# EasyEDA Pro project avaruusantenni_tallylight.eprj, schematic Schematic1

## Sheets
1 MCU: Create Date: 2023-07-29; Page Name: MCU; Project Name: avaruusantenni_tallylight; Schematic Name: Schematic1; Update Date: 2023-12-21; Company: EasyEDA.com; Drawed: EasyEDA Pro; Page Size: A4; Part Number: JLCPCB-002; Reviewed: EasyEDA Pro; Version: V0.1
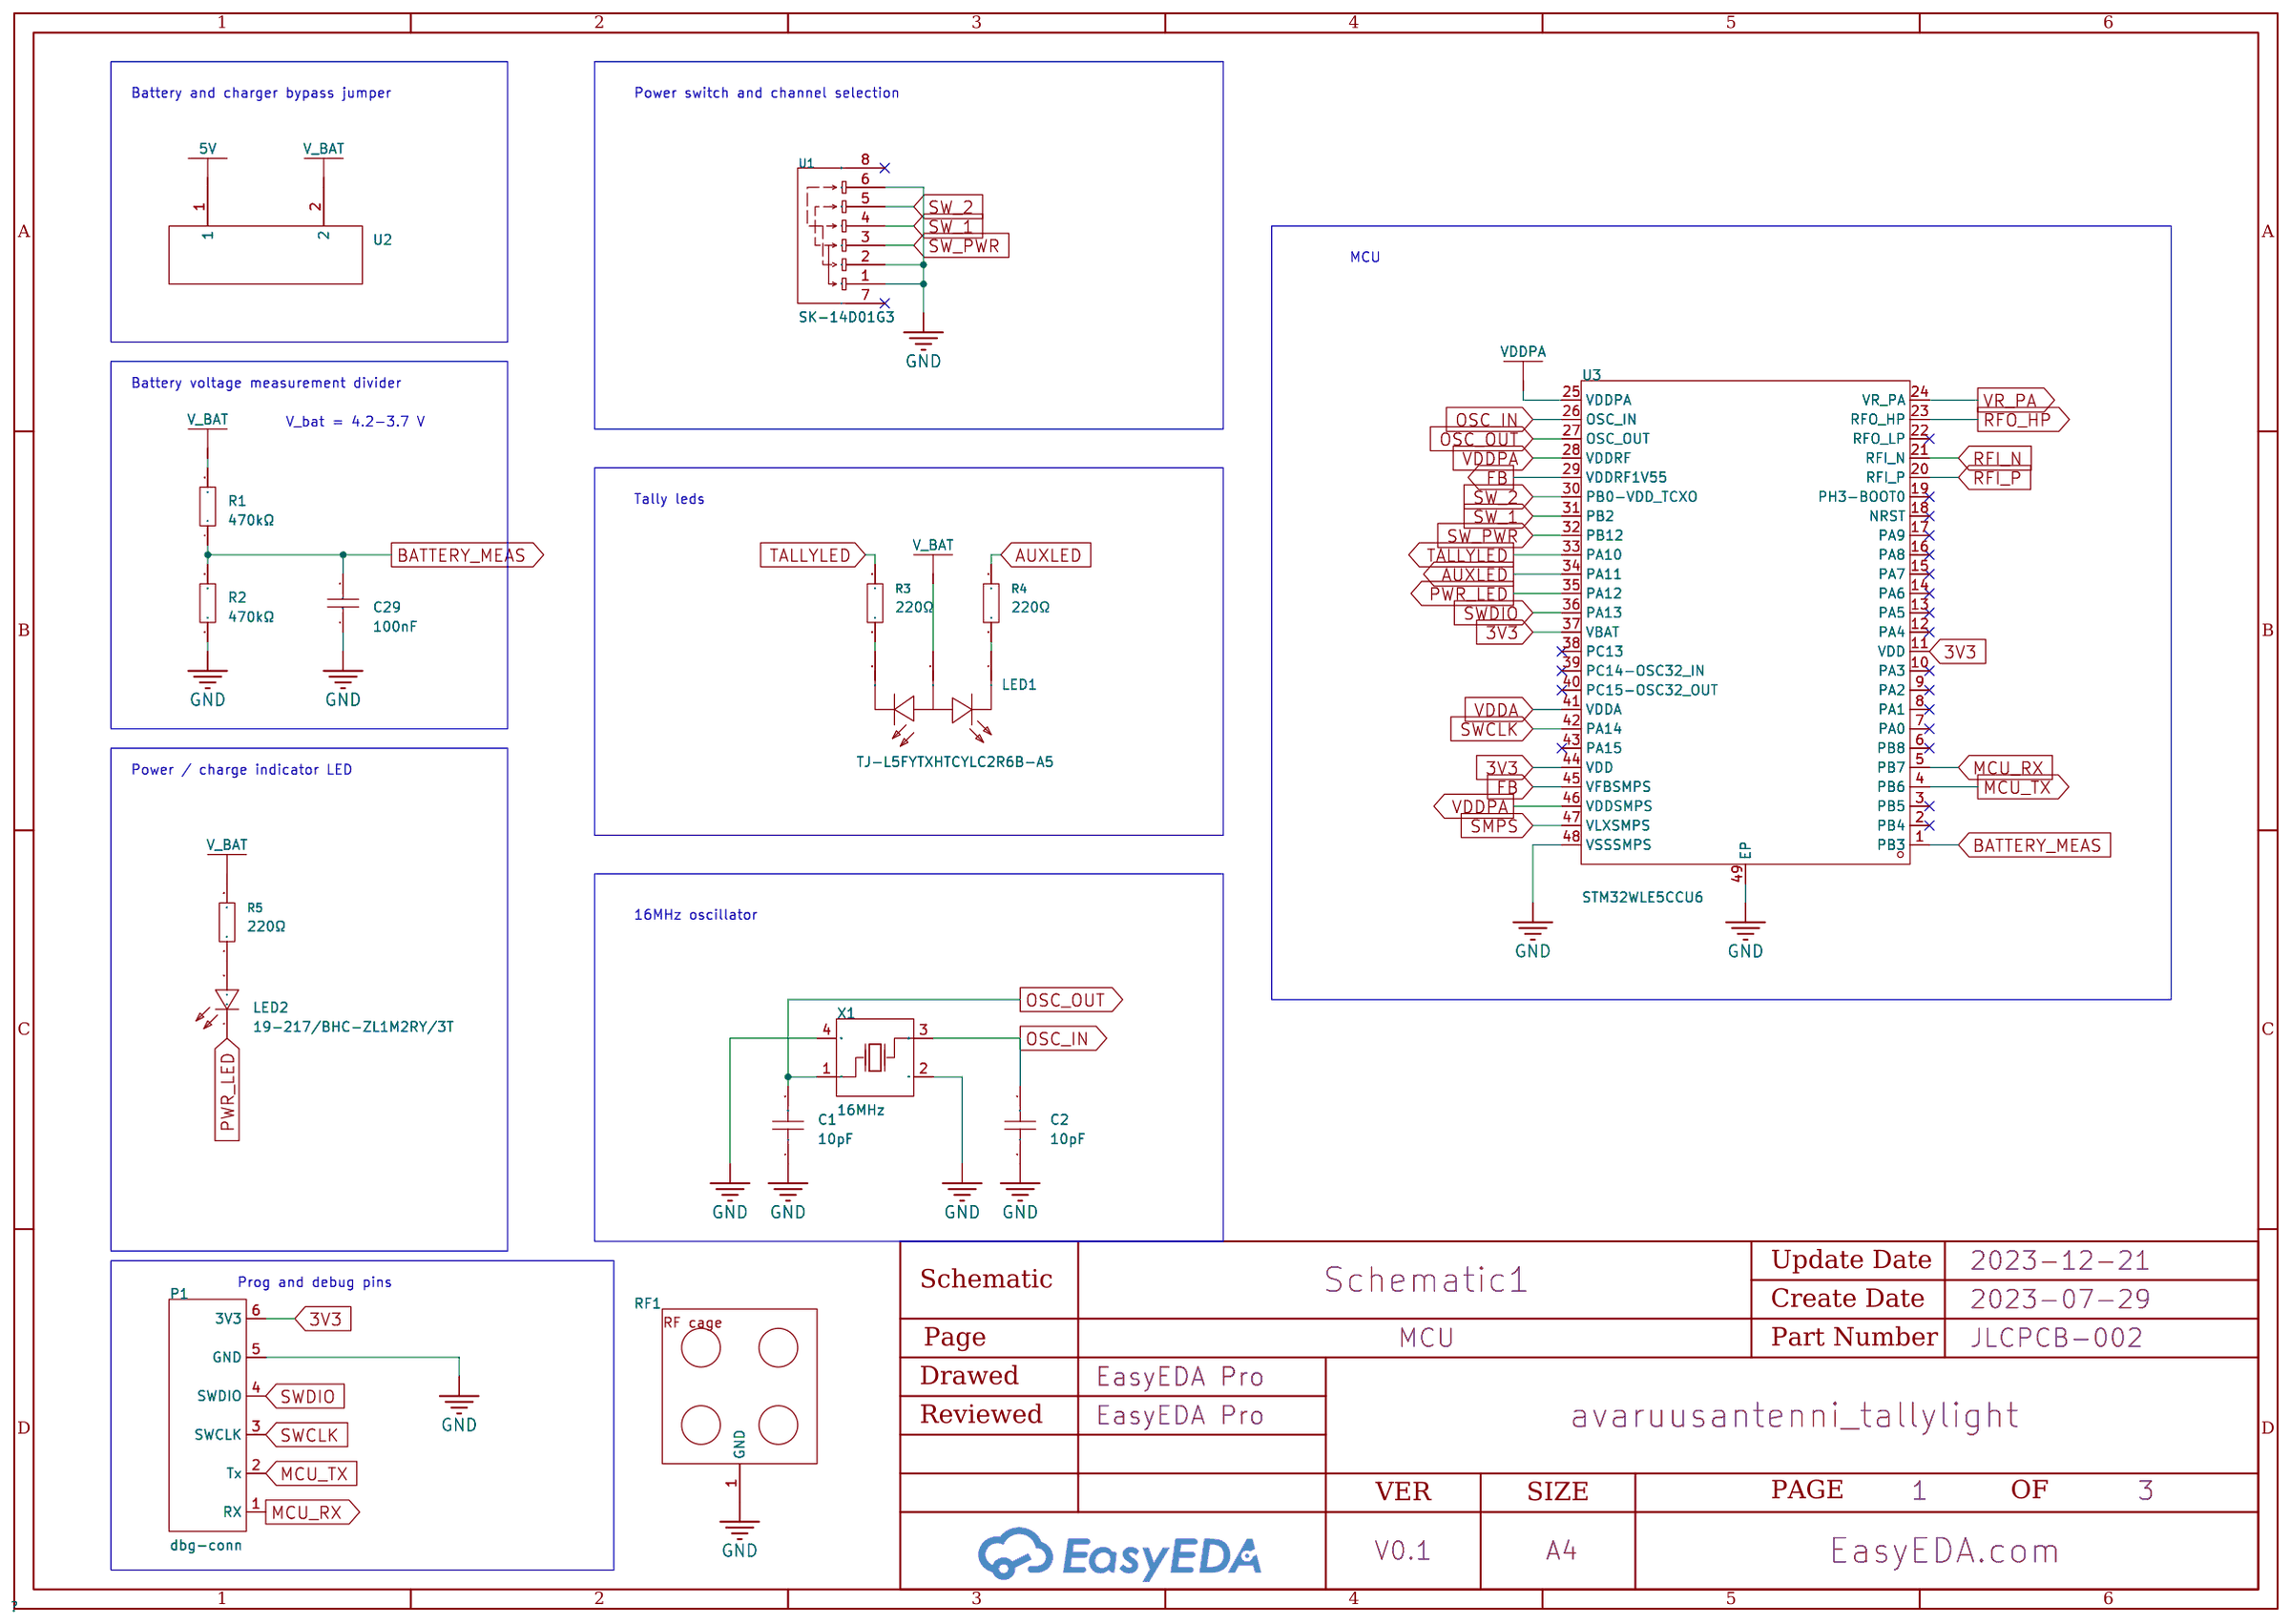
[diagram p0: MCU]
2 PWR: Create Date: 2023-10-14; Page Name: PWR
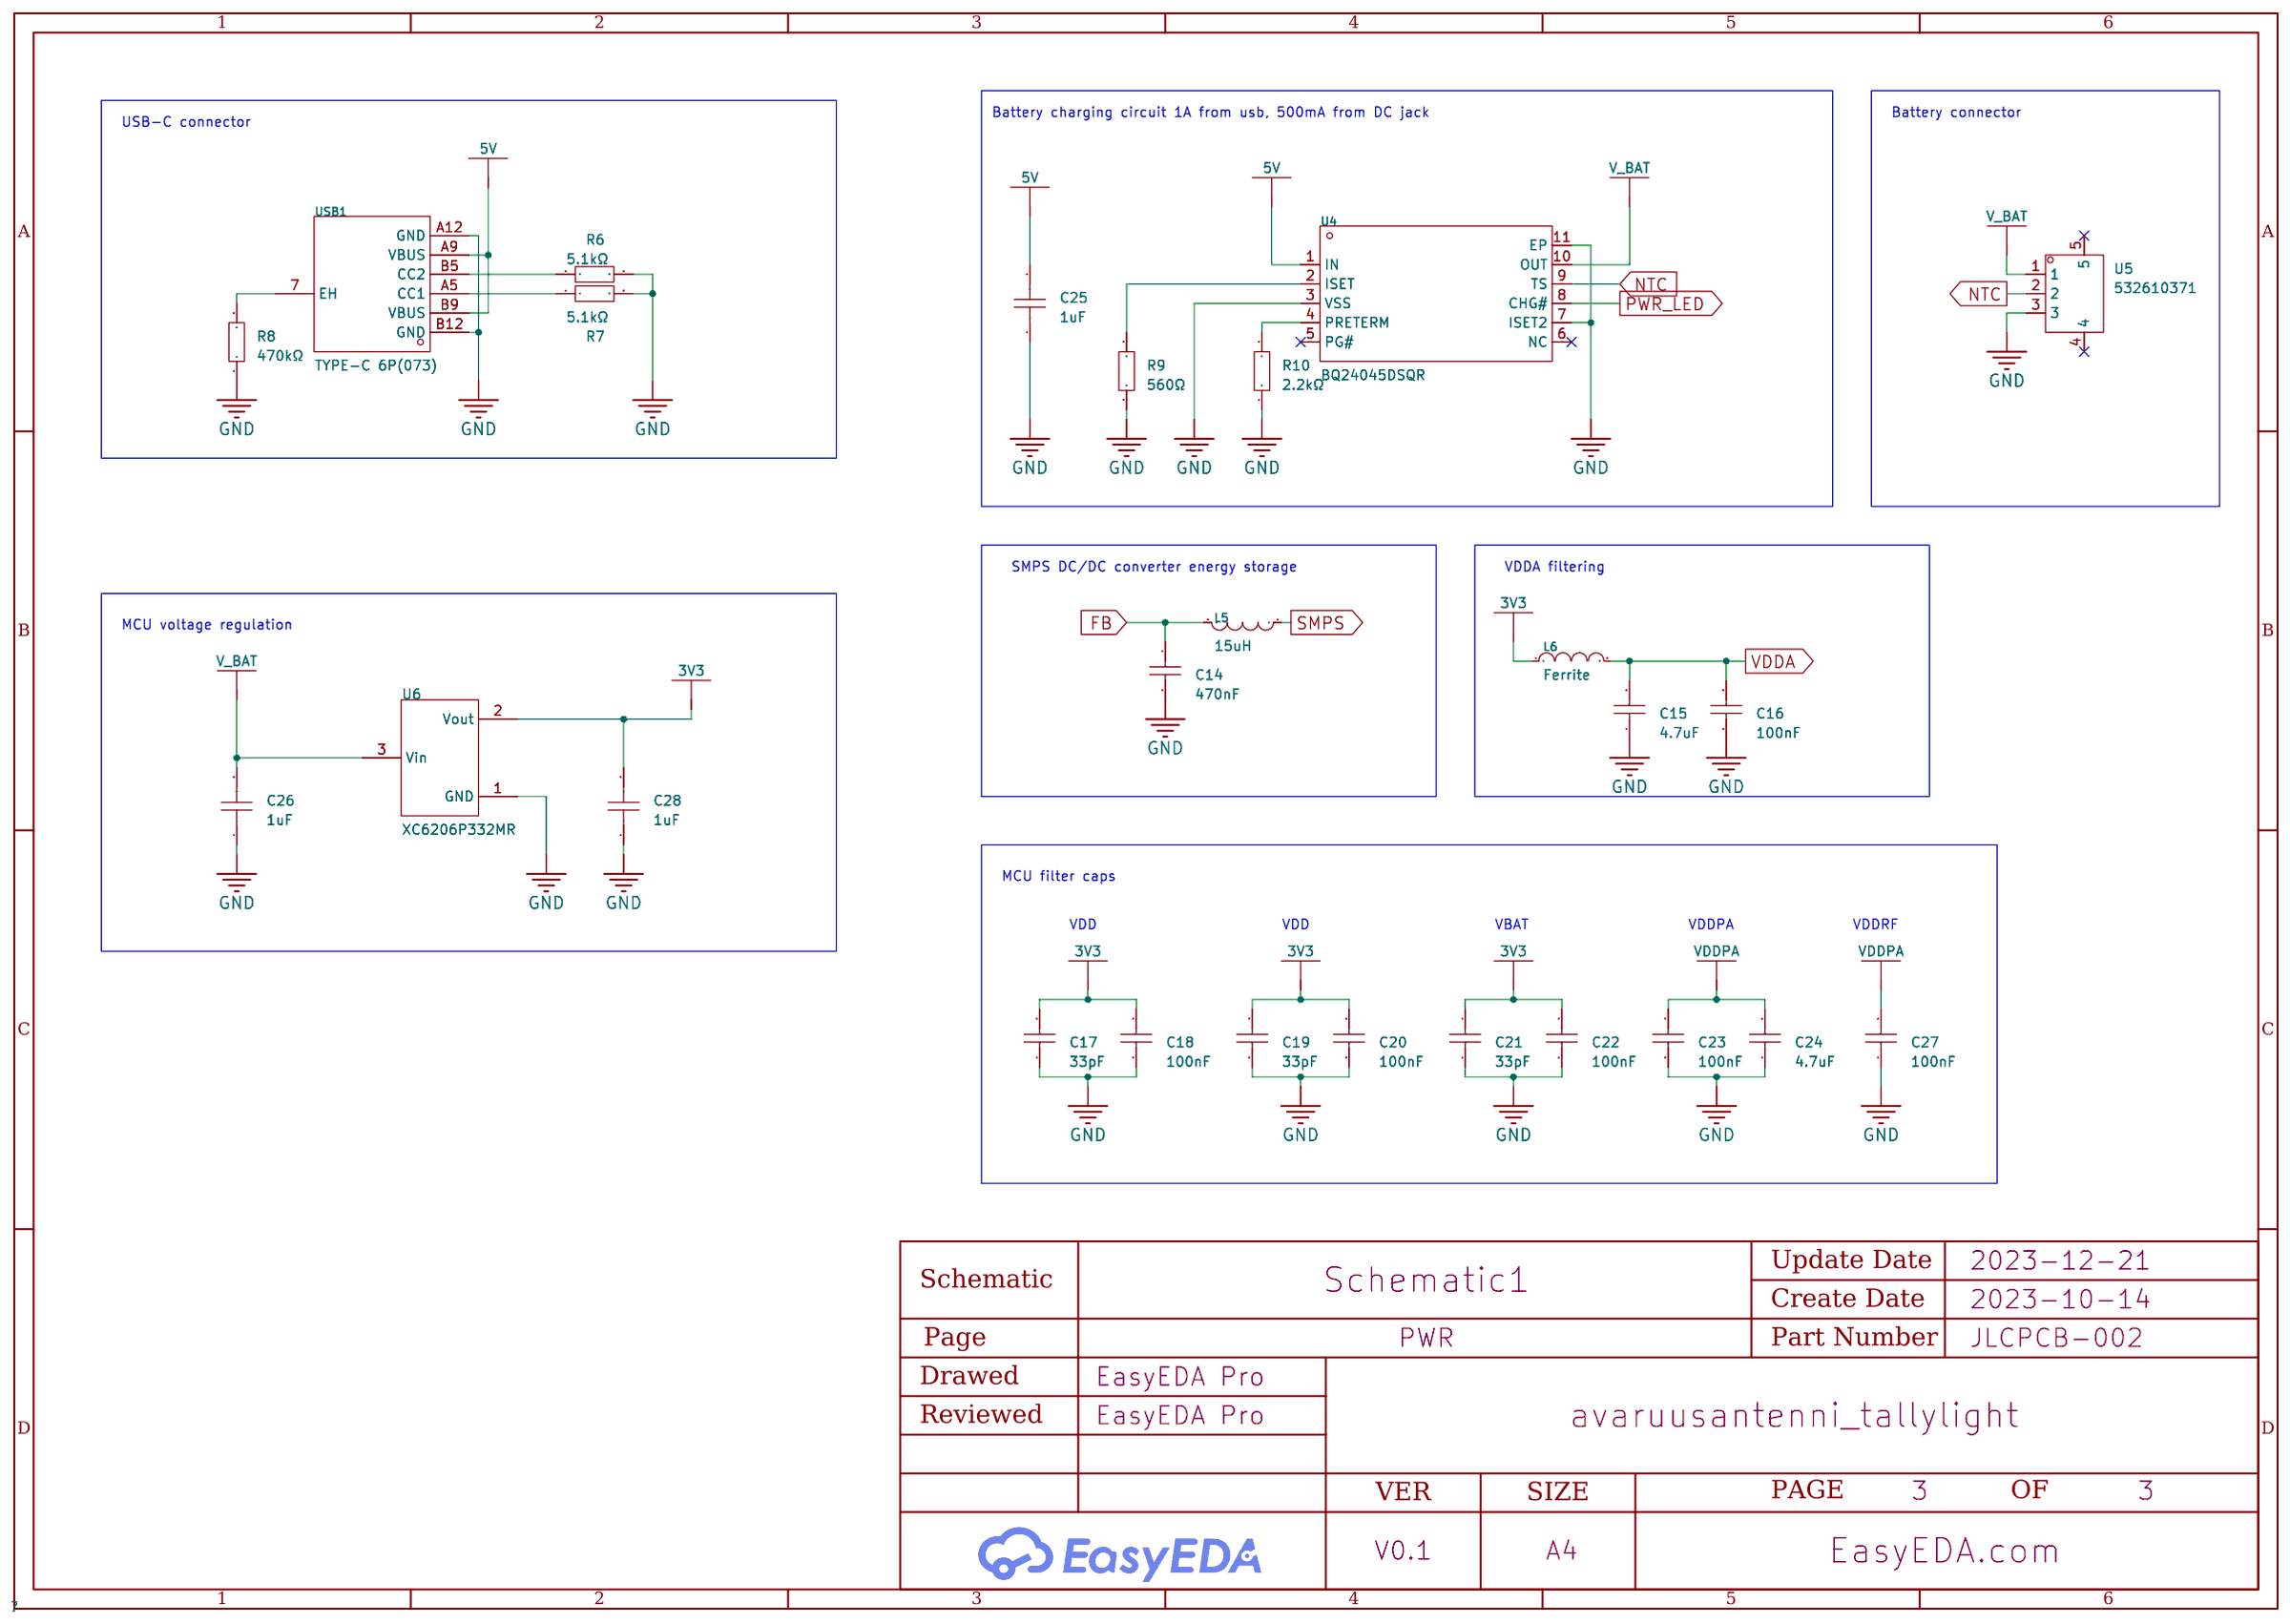
[diagram p1: PWR]
3 RF_Front: Create Date: 2023-10-14; Page Name: RF_Front
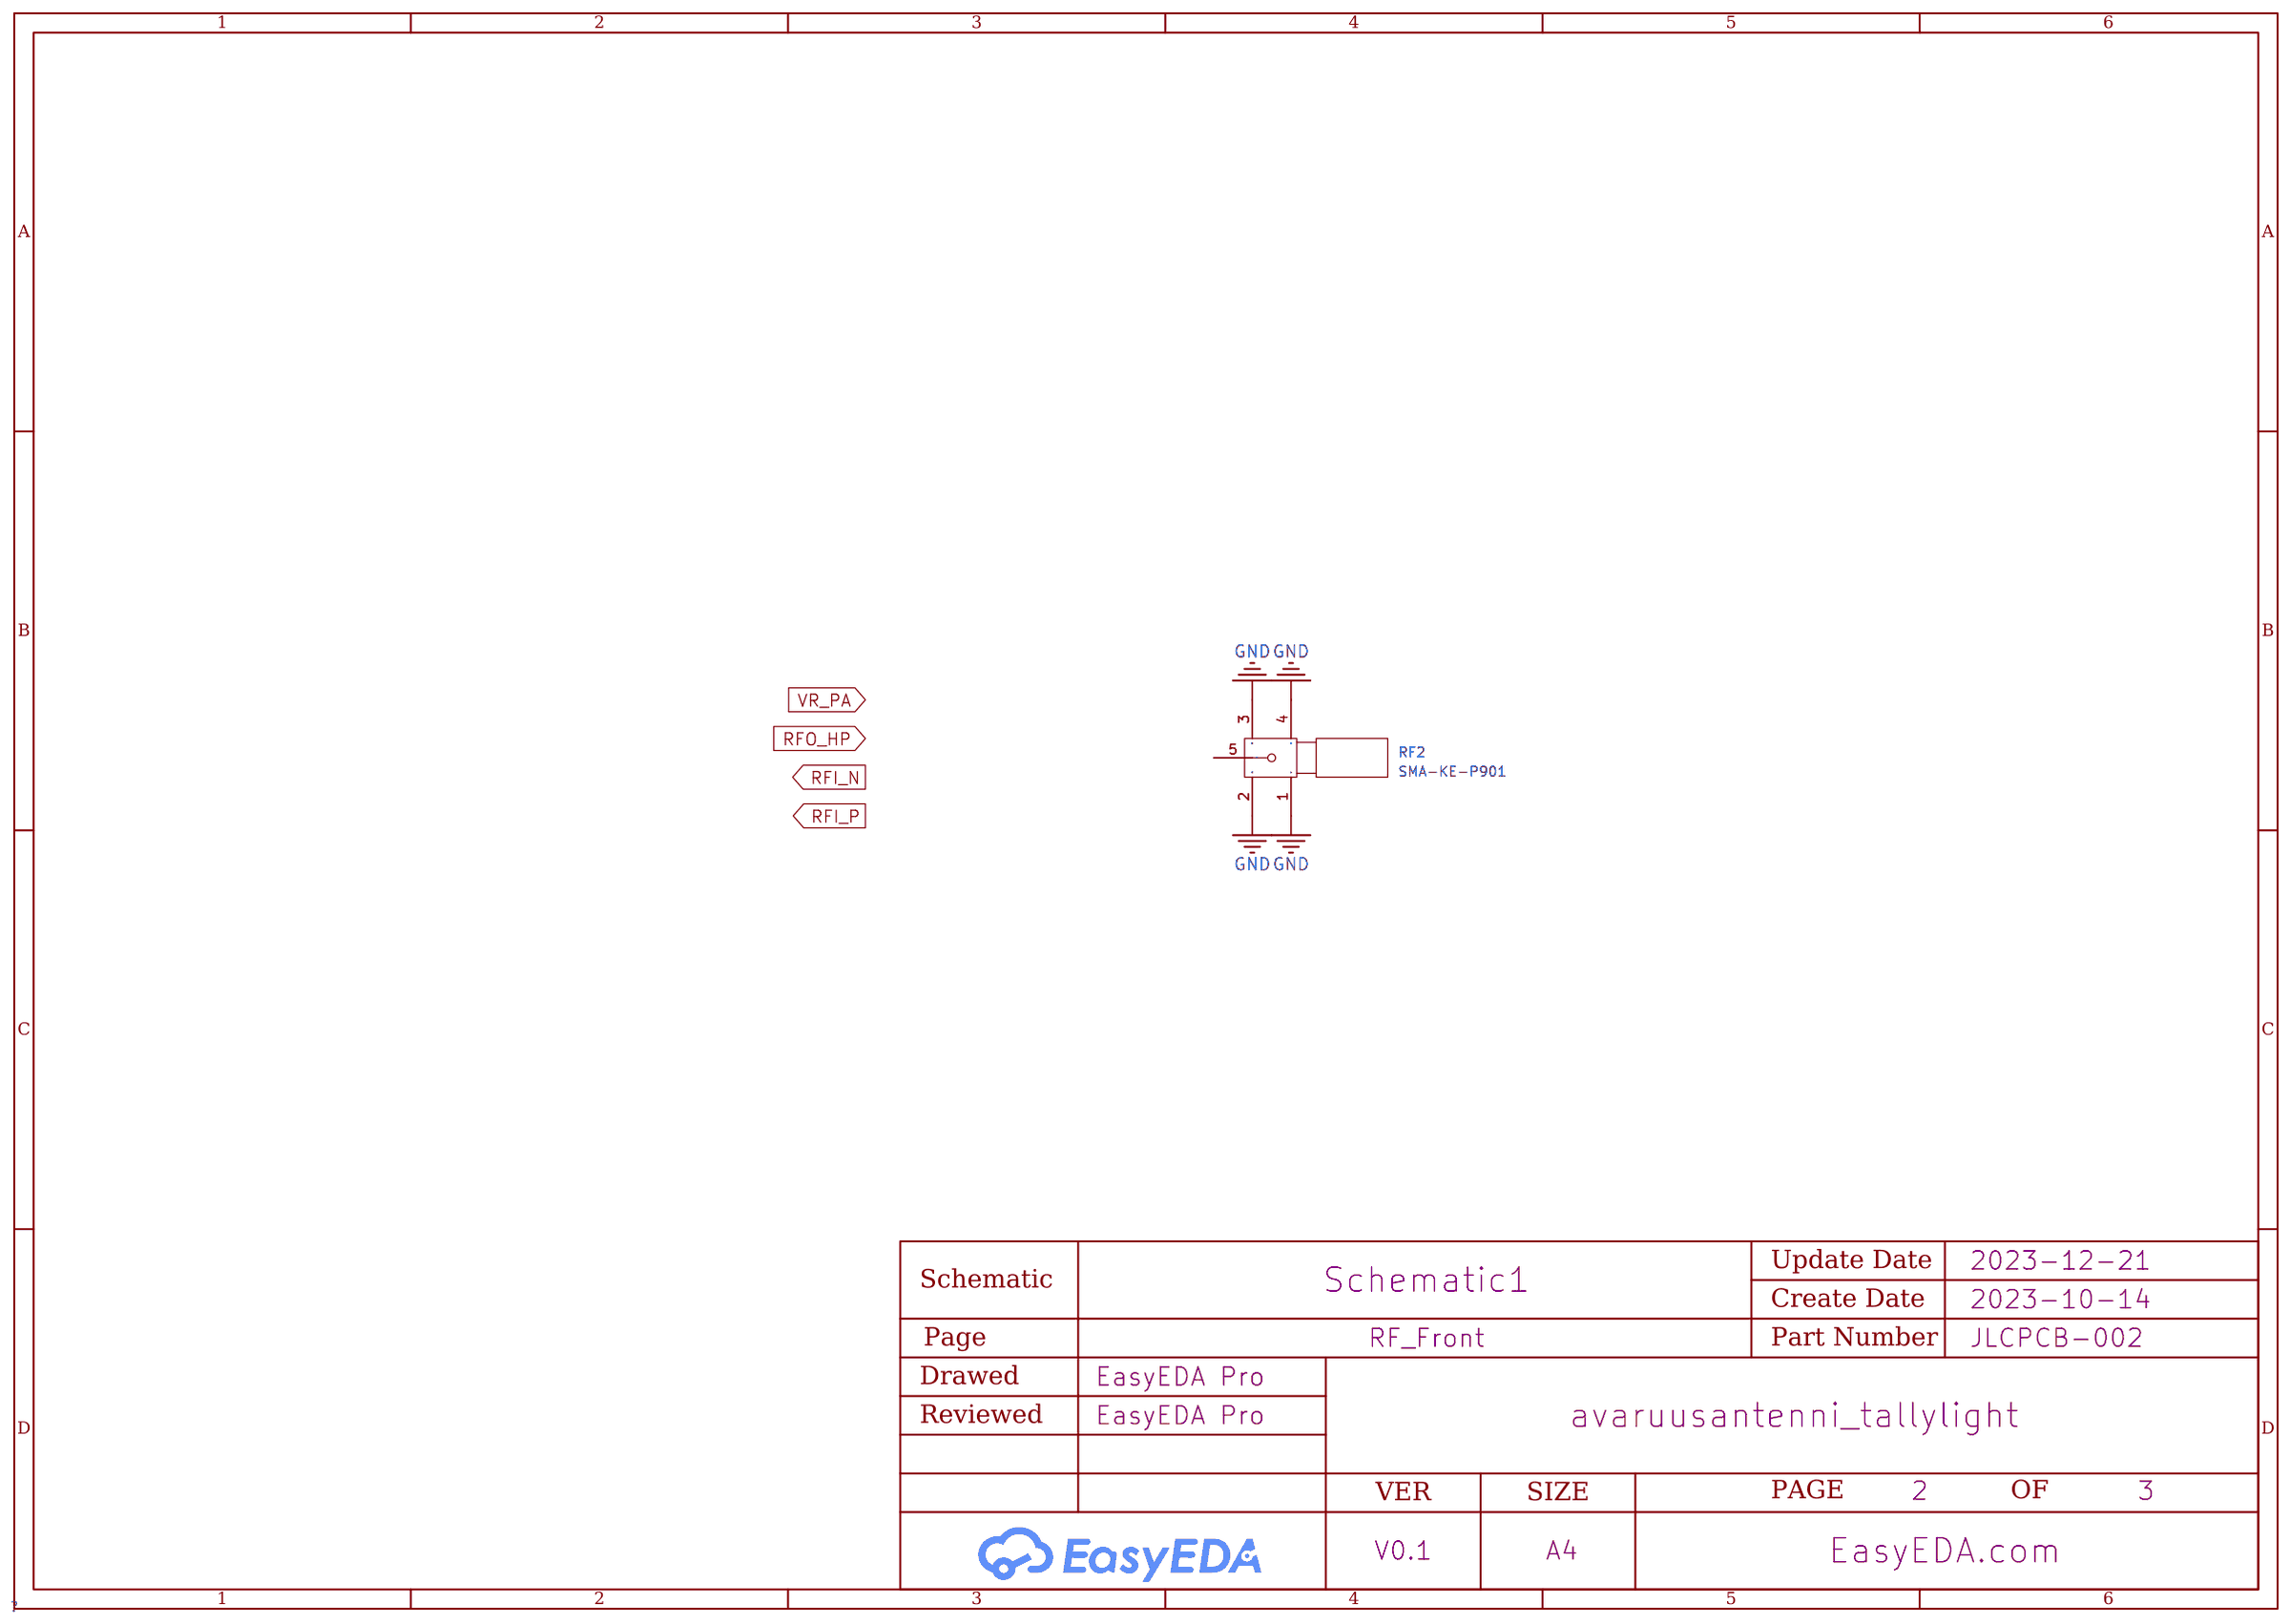
[diagram p2: RF_Front]

## Parts
sheet MCU
C1  10pF  [C0402]
C2  10pF  [C0402]
C29  100nF  [C0402]
LED1  TJ-L5FYTXHTCYLC2R6B-A5  [LED-TH_3P-BD5.9-P2.54-BI]  (no BOM)
LED2  19-217/BHC-ZL1M2RY/3T  [LED0603-FD_BLUE]  (no BOM)
P1  dbg-conn  [AA-DBG-1x6-2.54]  (no BOM)
R1  470kΩ  [R0603]
R2  470kΩ  [R0603]
R3  220Ω  [R0603]
R4  220Ω  [R0603]
R5  220Ω  [R0603]
RF1  -  [RF-cage-32x16mm]
U1  SK-14D01G3  [SW-TH_HOOYA_SK-14D01G3]  (no BOM)
U2  -  [solderbridge_L]  (no BOM)
U3  STM32WLE5CCU6  [UFQFPN-48_L7.0-W7.0-P0.50-BL-EP5.6]
X1  16MHz  [OSC-SMD_4P-L3.2-W2.5-BL]
sheet PWR
C14  470nF  [C0603]
C15  4.7uF  [C0402]
C16  100nF  [C0402]
C17  33pF  [C0402]
C18  100nF  [C0402]
C19  33pF  [C0402]
C20  100nF  [C0402]
C21  33pF  [C0402]
C22  100nF  [C0402]
C23  100nF  [C0402]
C24  4.7uF  [C0402]
C25  1uF  [C0402]
C26  1uF  [C0402]
C27  100nF  [C0402]
C28  1uF  [C0402]
L5  15uH  [L0805]
L6  Ferrite  [L0805]
R6  5.1kΩ  [R0402]
R7  5.1kΩ  [R0402]
R8  470kΩ  [R0603]
R9  560Ω  [R0603]
R10  2.2kΩ  [R0402]
U4  BQ24045DSQR  [WSON-10_L2.0-W2.0-P0.40-BL-EP]
U5  532610371  [CONN-TH_532610371]  (no BOM)
U6  XC6206P332MR  [SOT-23-3_L2.9-W1.6-P1.90-LS2.8-BR]
USB1  TYPE-C 6P(073)  [TYPE-C-SMD_TYPE-C-6P]  (no BOM)
sheet RF_Front
CBB1  b29a9d25234149e2a3663a5b9bef8dd2
RF2  SMA-KE-P901  [SMA-TH_SMA-KE-P901]  (no BOM)

## Library data of the parts
C1 C2 = CL05C100JB5NNNC: Capacitance: Tolerance:±5% Tolerance:±5% Voltage Rated: Temperature Coefficient:; LCSC Part Name: 10pF ±5% 50V; Supplier Part: C32949; Manufacturer: SAMSUNG(三星); Supplier Footprint: 0402; JLCPCB Part Class: Basic Part; Datasheet: https://atta.szlcsc.com/upload/public/pdf/source/20160103/1457707722238.pdf; Supplier: LCSC; Tolerance: ±5%
C16 C18 C20 C22 C23 C27 C29 = CL05B104KO5NNNC: Capacitance: Tolerance:±10% Tolerance:±10% Voltage Rated: Temperature Coefficient:; LCSC Part Name: 100nF ±10% 16V; Supplier Part: C1525; Manufacturer: SAMSUNG(三星); Supplier Footprint: 0402; JLCPCB Part Class: Basic Part; Datasheet: https://atta.szlcsc.com/upload/public/pdf/source/20160103/1457707674891.pdf; Supplier: LCSC; Tolerance: ±10%
LED1 = TJ-L5FYTXHTCYLC2R6B-A5: Emitted Color:橙红,蓝灯 Diode Configuration:Common anode Lens Color:Colorless transparence Dominant Wavelength:620nm~630nm；460nm~470nm Dominant Wavelength:620nm~630nm；460nm~470nm Peak Wavelength:468nm；630nm Color Temperature:- Color Temperature:- Forward Curr; LCSC Part Name: 橙红,蓝灯 圆头; Supplier Part: C440428; Manufacturer: TOGIALED(统佳); Supplier Footprint: 插件,D=5mm; JLCPCB Part Class: Extended Part; Datasheet: https://atta.szlcsc.com/upload/public/pdf/source/20191029/C440428_7A633C0B15D7D89F536BF5ABFECB6C39.pdf; Supplier: LCSC; Emitted Color: 橙红,蓝灯; Diode Configuration: Common anode; Lens Color: Colorless transparence; Dominant Wavelength: 620nm~630nm；460nm~470nm; Peak Wavelength: 468nm；630nm; Forward Current: 20mA; Power Dissipation: 180mW; Operating Temperature: -20℃~+80℃; Lamp Holder Type: 5mm圆形灯头
LED2 = 19-217/BHC-ZL1M2RY/3T: Emitted Color:blue Diode Configuration:- Lens Color:Colorless transparence Dominant Wavelength:465nm~475nm Dominant Wavelength:465nm~475nm Peak Wavelength:468nm Color Temperature:- Color Temperature:- Forward Current:5mA Power Dissipation:110mW Viewing An; LCSC Part Name: 蓝灯; Supplier Part: C72041; Manufacturer: EVERLIGHT(亿光); Supplier Footprint: 0603; JLCPCB Part Class: Basic Part; Datasheet: https://atta.szlcsc.com/upload/public/pdf/source/20170116/1484561237273.pdf; Supplier: LCSC; Emitted Color: blue; Lens Color: Colorless transparence; Dominant Wavelength: 465nm~475nm; Peak Wavelength: 468nm; Forward Current: 5mA; Power Dissipation: 110mW; Viewing Angle: 120°; Operating Temperature: -40℃~+85℃
P1 = AA-DBG-1x6-L: The Avaruusantenni standard debug connector variant with a pin layout of 1 x 6 with 2.54 mm (100 mil) pitch
R1 R2 R8 = 0603WAF4703T5E: Type:Thick Film Resistors Resistance: Tolerance:±1% Tolerance:±1% Power(Watts): Temperature Coefficient:±100ppm/℃ Temperature Coefficient:±100ppm/℃ Overload Voltage (Max): Operating Temperature Range:-55℃~+155℃ Operating Temperature Range:-55℃~+155℃; LCSC Part Name: 470kΩ ±1% 100mW; Supplier Part: C23178; Manufacturer: UNI-ROYAL(厚声); Supplier Footprint: 0603; JLCPCB Part Class: Basic Part; Datasheet: https://atta.szlcsc.com/upload/public/pdf/source/20200306/C422600_1E6D84923E4A46A82E41ADD87F860B5C.pdf; Supplier: LCSC; Type: Thick Film Resistors; Tolerance: ±1%; Temperature Coefficient: ±100ppm/℃; Operating Temperature Range: -55℃~+155℃
R3-R5 = 0603WAF2200T5E: Type:Thick Film Resistors Resistance: Tolerance:±1% Tolerance:±1% Power(Watts): Temperature Coefficient:±100ppm/℃ Temperature Coefficient:±100ppm/℃ Overload Voltage (Max): Operating Temperature Range:-55℃~+155℃ Operating Temperature Range:-55℃~+155℃; LCSC Part Name: 厚膜电阻 220Ω ±1% 100mW; Supplier Part: C22962; Manufacturer: UNI-ROYAL(厚声); Supplier Footprint: 0603; JLCPCB Part Class: Basic Part; Datasheet: https://atta.szlcsc.com/upload/public/pdf/source/20200306/C422600_1E6D84923E4A46A82E41ADD87F860B5C.pdf; Supplier: LCSC; Type: Thick Film Resistors; Tolerance: ±1%; Temperature Coefficient: ±100ppm/℃; Operating Temperature Range: -55℃~+155℃
RF1 = rf_cage
U1 = SK-14D01G3: Supplier Part: C2939335; Manufacturer: HOOYA(皓宇电子); Supplier Footprint: 插件,4.5x12.7mm; JLCPCB Part Class: Extended Part; Datasheet: https://atta.szlcsc.com/upload/public/pdf/source/20220518/94A09AD23E7AFBF2EFCDE188F9E51A0E.pdf; Supplier: LCSC
U2 = charger-bypass: A jumper to bypass the charger IC and connect power directly from 5V
U3 = STM32WLE5CCU6: Supplier Part: C2888218; Manufacturer: ST(意法半导体); Supplier Footprint: UFQFPN-48(7x7); JLCPCB Part Class: Extended Part; Datasheet: https://atta.szlcsc.com/upload/public/pdf/source/20220805/73C544F8A874B6EECCDD18E2DF490EB3.pdf; Supplier: LCSC
X1 = X322516MLB4SI: Crystal Type:SMD Crystal Resonator Frequency: Frequency Tolerance:±10ppm Frequency Tolerance:±10ppm Frequency Stability:±30ppm Frequency Stability:±30ppm Load Capacitance: Operating Temperature: Operating Temperature:; LCSC Part Name: 16MHz ±10ppm 9pF YSX321SL; Supplier Part: C13738; Manufacturer: YXC(扬兴晶振); Supplier Footprint: SMD3225-4P; JLCPCB Part Class: Basic Part; Datasheet: https://atta.szlcsc.com/upload/public/pdf/source/20210329/C112971_1F611BDC486E193C1706F6D8EB5AA189.pdf; Supplier: LCSC; Crystal Type: SMD Crystal Resonator; Frequency Tolerance: ±10ppm; Frequency Stability: ±30ppm
C14 = CL10B474KA8NNNC: Capacitance: Tolerance:±10% Tolerance:±10% Voltage Rated: Temperature Coefficient:; LCSC Part Name: 470nF ±10% 25V; Supplier Part: C1623; Manufacturer: SAMSUNG(三星); Supplier Footprint: 0603; JLCPCB Part Class: Basic Part; Datasheet: https://atta.szlcsc.com/upload/public/pdf/source/20160103/1457707685435.pdf; Supplier: LCSC; Tolerance: ±10%
C15 C24 = CL05A475MP5NRNC: Capacitance: Tolerance:±20% Tolerance:±20% Voltage Rated: Temperature Coefficient:; LCSC Part Name: 4.7uF ±20% 10V; Supplier Part: C23733; Manufacturer: SAMSUNG(三星); Supplier Footprint: 0402; JLCPCB Part Class: Basic Part; Datasheet: https://atta.szlcsc.com/upload/public/pdf/source/20160103/1457707710457.pdf; Supplier: LCSC; Tolerance: ±20%
C17 C19 C21 = 0402CG330J500NT: Capacitance: Tolerance:±5% Tolerance:±5% Voltage Rated: Temperature Coefficient:; LCSC Part Name: 33pF ±5% 50V; Supplier Part: C1562; Manufacturer: FH(风华); Supplier Footprint: 0402; JLCPCB Part Class: Basic Part; Datasheet: https://atta.szlcsc.com/upload/public/pdf/source/20200305/C486355_26A10D38EF8C2A5C37091D0039909270.pdf; Supplier: LCSC; Tolerance: ±5%
C25 C26 C28 = CL05A105KA5NQNC: Capacitance: Tolerance:±10% Tolerance:±10% Voltage Rated: Temperature Coefficient:; LCSC Part Name: 1uF ±10% 25V; Supplier Part: C52923; Manufacturer: SAMSUNG(三星); Supplier Footprint: 0402; JLCPCB Part Class: Basic Part; Datasheet: https://atta.szlcsc.com/upload/public/pdf/source/20160103/1457707735223.pdf; Supplier: LCSC; Tolerance: ±10%
L5 = MLZ2012M150WT000: Inductance: Tolerance:±20% Tolerance:±20% Rated Current:- Saturation Current (Isat):120mA DC Resistance (DCR): Q @ Freq:- Frequency - Self Resonant: Ratings:; LCSC Part Name: 15uH ±20% 120mA; Supplier Part: C383402; Manufacturer: TDK; Supplier Footprint: 0805; JLCPCB Part Class: Extended Part; Datasheet: https://atta.szlcsc.com/upload/public/pdf/source/20200324/C383404_6F95903E86AEDF16368640ABB3D81E0E.pdf; Supplier: LCSC; Tolerance: ±20%; Saturation Current (Isat): 120mA
L6 = GZ2012D601TF: Impedance @ Frequency:600Ω@100MHz Tolerance:±25% Tolerance:±25% DC Resistance:300mΩ Current Rating:500mA Circuits:1; LCSC Part Name: 单路 0805磁珠 阻抗600Ω@100MHz; Supplier Part: C1017; Manufacturer: Sunlord(顺络); Supplier Footprint: 0805; JLCPCB Part Class: Basic Part; Datasheet: https://atta.szlcsc.com/upload/public/pdf/source/20210830/355EA7C0FAC5394FC0FE3F17C770C20A.pdf; Supplier: LCSC; Impedance @ Frequency: 600Ω@100MHz; Tolerance: ±25%; DC Resistance: 300mΩ; Current Rating: 500mA; Circuits: 1
R6 R7 = 0402WGF5101TCE: Type:Thick Film Resistors Resistance: Tolerance:±1% Tolerance:±1% Power(Watts): Temperature Coefficient:±100ppm/℃ Temperature Coefficient:±100ppm/℃ Overload Voltage (Max): Operating Temperature Range:-55℃~+155℃ Operating Temperature Range:-55℃~+155℃; LCSC Part Name: 5.1kΩ ±1% 62.5mW; Supplier Part: C25905; Manufacturer: UNI-ROYAL(厚声); Supplier Footprint: 0402; JLCPCB Part Class: Basic Part; Datasheet: https://atta.szlcsc.com/upload/public/pdf/source/20200306/C422600_1E6D84923E4A46A82E41ADD87F860B5C.pdf; Supplier: LCSC; Type: Thick Film Resistors; Tolerance: ±1%; Temperature Coefficient: ±100ppm/℃; Operating Temperature Range: -55℃~+155℃
R9 = 0603WAF5600T5E: Type:Thick Film Resistors Resistance: Tolerance:±1% Tolerance:±1% Power(Watts): Temperature Coefficient:±100ppm/℃ Temperature Coefficient:±100ppm/℃ Overload Voltage (Max): Operating Temperature Range:-55℃~+155℃ Operating Temperature Range:-55℃~+155℃; LCSC Part Name: 560Ω ±1% 100mW; Supplier Part: C23204; Manufacturer: UNI-ROYAL(厚声); Supplier Footprint: 0603; JLCPCB Part Class: Basic Part; Datasheet: https://atta.szlcsc.com/upload/public/pdf/source/20200306/C422600_1E6D84923E4A46A82E41ADD87F860B5C.pdf; Supplier: LCSC; Type: Thick Film Resistors; Tolerance: ±1%; Temperature Coefficient: ±100ppm/℃; Operating Temperature Range: -55℃~+155℃
R10 = 0402WGF2201TCE: Type:Thick Film Resistors Resistance: Tolerance:±1% Tolerance:±1% Power(Watts): Temperature Coefficient:±100ppm/℃ Temperature Coefficient:±100ppm/℃ Overload Voltage (Max): Operating Temperature Range:-55℃~+155℃ Operating Temperature Range:-55℃~+155℃; LCSC Part Name: 2.2kΩ ±1% 62.5mW; Supplier Part: C25879; Manufacturer: UNI-ROYAL(厚声); Supplier Footprint: 0402; JLCPCB Part Class: Basic Part; Datasheet: https://atta.szlcsc.com/upload/public/pdf/source/20200306/C422600_1E6D84923E4A46A82E41ADD87F860B5C.pdf; Supplier: LCSC; Type: Thick Film Resistors; Tolerance: ±1%; Temperature Coefficient: ±100ppm/℃; Operating Temperature Range: -55℃~+155℃
U4 = BQ24045DSQR: Supplier Part: C148983; Manufacturer: TI(德州仪器); Supplier Footprint: DFN-10(2x2); JLCPCB Part Class: Extended Part; Datasheet: https://www.ti.com/cn/lit/gpn/bq24045; Supplier: LCSC
U5 = 532610371: Reference Series:- Pitch:1.25mm Pins Structure:1x3P Number of Rows:1 Number of PINs Per Row:3 Row Spacing:- Mounting Style:- Contact Material:bronze; LCSC Part Name: 1.25mm 1x3P; Supplier Part: C293630; Manufacturer: MOLEX; Supplier Footprint: SMD,P=1.25mm; JLCPCB Part Class: Extended Part; Datasheet: https://atta.szlcsc.com/upload/public/pdf/source/20181030/C293630_644FD371948C92BD51E6614399C64E30.pdf; Supplier: LCSC; Pitch: 1.25mm; Pins Structure: 1x3P; Number of Rows: 1; Number of PINs Per Row: 3; Contact Material: bronze; NO_CONNECT: yes
U6 = XC6206P332MR_C5446: Output Type: Output Polarity:Positive Number of Outputs:1 Maximum Input Voltage:6V Output Voltage:3.3V~3.3V Output Voltage:3.3V~3.3V Dropout Voltage:680mV@(100mA) Output Current:200mA Power Supply Rejection Ratio (PSRR):-; Supplier Part: C5446; Manufacturer: TOREX(特瑞仕); Supplier Footprint: SOT-23-3L; JLCPCB Part Class: Basic Part; Datasheet: https://atta.szlcsc.com/upload/public/pdf/source/20130801/1457706628791.pdf; Supplier: LCSC; Output Polarity: Positive; Number of Outputs: 1; Maximum Input Voltage: 6V; Output Voltage: 3.3V~3.3V; Dropout Voltage: 680mV@(100mA); Output Current: 200mA
USB1 = TYPE-C 6P(073): Connector Type:Type-C Standard:- Gender:Female Number of Contacts:6P Number of Ports:1 Mounting Style:Surface Mount Current Rating - Power (Max):5A Operating Temperature Range:-25℃~+85℃ Operating Temperature Range:-25℃~+85℃; LCSC Part Name: Type-C 母座 卧贴; Supplier Part: C668623; Manufacturer: SHOU HAN(首韩); Supplier Footprint: SMD; JLCPCB Part Class: Extended Part; Datasheet: https://atta.szlcsc.com/upload/public/pdf/source/20200618/C668623_A4B260DED7AC1949BAC6AE39E9F4CD80.pdf; Supplier: LCSC; Connector Type: Type-C; Gender: Female; Number of Contacts: 6P; Number of Ports: 1; Mounting Style: Surface Mount; Current Rating - Power (Max): 5A; Operating Temperature Range: -25℃~+85℃
RF2 = SMA-KE-P901: Connector Type:板端 RF Series:RP-SMA Interface Type:内针 Number of Ports:1 Impedance:50Ω Frequency-Max:3GHz Style:偏脚 Interface Diameter:5.35mm Interface Length/Height:- Operating Temperature Range:-55℃~+125℃ Operating Temperature Range:-55℃~+125℃; LCSC Part Name: RP-SMA 内针 偏脚; Supplier Part: C914556; Manufacturer: DreamLNK(骏晔科技); Supplier Footprint: 插件; JLCPCB Part Class: Extended Part; Datasheet: https://atta.szlcsc.com/upload/public/pdf/source/20201104/C914556_6716DB066E64EC6AFA3017BF070429A4.pdf; Supplier: LCSC; Connector Type: 板端; RF Series: RP-SMA; Interface Type: 内针; Number of Ports: 1; Impedance: 50Ω; Frequency-Max: 3GHz; Style: 偏脚; Interface Diameter: 5.35mm; Operating Temperature Range: -55℃~+125℃

## Nets
3V3: C17.2 C18.2 C19.2 C20.2 C21.2 C22.2 C28.2 L6.1 P1.6(3V3) U3.11(VDD) U3.37(VBAT) U3.44(VDD) U6.2(Vout)
5V: C25.2 U2.1 U4.1(IN) USB1.A9(VBUS) USB1.B9(VBUS)
GND: C1.1 C2.2 C14.1 C15.1 C16.1 C17.1 C18.1 C19.1 C20.1 C21.1 C22.1 C23.1 C24.1 C25.1 C26.1 C27.1 C28.1 C29.1 P1.5(GND) R2.1 R6.2 R7.2 R8.1 R9.1 R10.1 RF1.1(GND) RF2.1 RF2.2 RF2.3 RF2.4 U1.1 U1.2 U1.6 U3.48(VSSSMPS) U3.49(EP) U4.3(VSS) U4.7(ISET2) U4.11(EP) U5.3 U6.1(GND) USB1.A12(GND) USB1.B12(GND) X1.2(GND) X1.4(GND)
VDDA: C15.2 C16.2 L6.2 U3.41(VDDA)
VDDPA: C23.2 C24.2 C27.2 U3.25(VDDPA) U3.28(VDDRF) U3.46(VDDSMPS)
AUXLED: R4.1 U3.34(PA11)
BATTERY_MEAS: C29.2 R1.1 R2.2 U3.1(PB3)
FB: C14.2 L5.2 U3.29(VDDRF1V55) U3.45(VFBSMPS)
MCU_RX: P1.1(RX) U3.5(PB7)
MCU_TX: P1.2(Tx) U3.4(PB6)
NTC: U4.9(TS) U5.2
OSC_IN: C2.1 U3.26(OSC_IN) X1.3(OSC2)
OSC_OUT: C1.2 U3.27(OSC_OUT) X1.1(OSC1)
PWR_LED: LED2.1(C) U3.35(PA12) U4.8(CHG#)
RFI_N: CBB1.(ANT) RF2.5 U3.20(RFI_P) U3.21(RFI_N) U3.23(RFO_HP) U3.24(VR_PA)
SMPS: L5.1 U3.47(VLXSMPS)
SW_1: U1.4 U3.31(PB2)
SW_2: U1.5 U3.30(PB0-VDD_TCXO)
SW_PWR: U1.3 U3.32(PB12)
SWCLK: P1.3(SWCLK) U3.42(PA14)
SWDIO: P1.4(SWDIO) U3.36(PA13)
TALLYLED: R3.2 U3.33(PA10)
V_BAT: C26.2 LED1.2 R1.2 R5.2 U2.2 U4.10(OUT) U5.1 U6.3(Vin)
$1N8346: LED2.2(A) R5.1
$1N9891: LED1.3 R3.1
$1N9911: LED1.1 R4.2
$2N347: R7.1 USB1.A5(CC1)
$2N453: R6.1 USB1.B5(CC2)
$2N553: R8.2 USB1.7(EH)
$2N1572: R9.2 U4.2(ISET)
$2N1736: R10.2 U4.4(PRETERM)

Not connected (* = marked no-connect by the designer): U1 7* 8*; U3 2(PB4)* 3(PB5)* 6(PB8)* 7(PA0)* 8(PA1)* 9(PA2)* 10(PA3)* 12(PA4)* 13(PA5)* 14(PA6)* 15(PA7)* 16(PA8)* 17(PA9)* 18(NRST)* 19(PH3-BOOT0)* 22(RFO_LP)* 38(PC13)* 39(PC14-OSC32_IN)* 40(PC15-OSC32_OUT)* 43(PA15)*; U4 5(PG#)* 6(NC)*; U5 4* 5*

## Notes on the sheets
sheet 1
- Battery and charger bypass jumper
- Power switch and channel selection
- MCU
- Battery voltage measurement divider
- V_bat = 4.2-3.7 V
- Tally leds
- Power / charge indicator LED
- 16MHz oscillator
- Prog and debug pins
sheet 2
- USB-C connector
- Battery charging circuit 1A from usb, 500mA from DC jack
- Battery connector
- SMPS DC/DC converter energy storage
- VDDA filtering
- MCU voltage regulation
- MCU filter caps
- VDD
- VDD
- VBAT
- VDDPA
- VDDRF
